# EAGLE design ardulight (EAGLE 7.1.0)
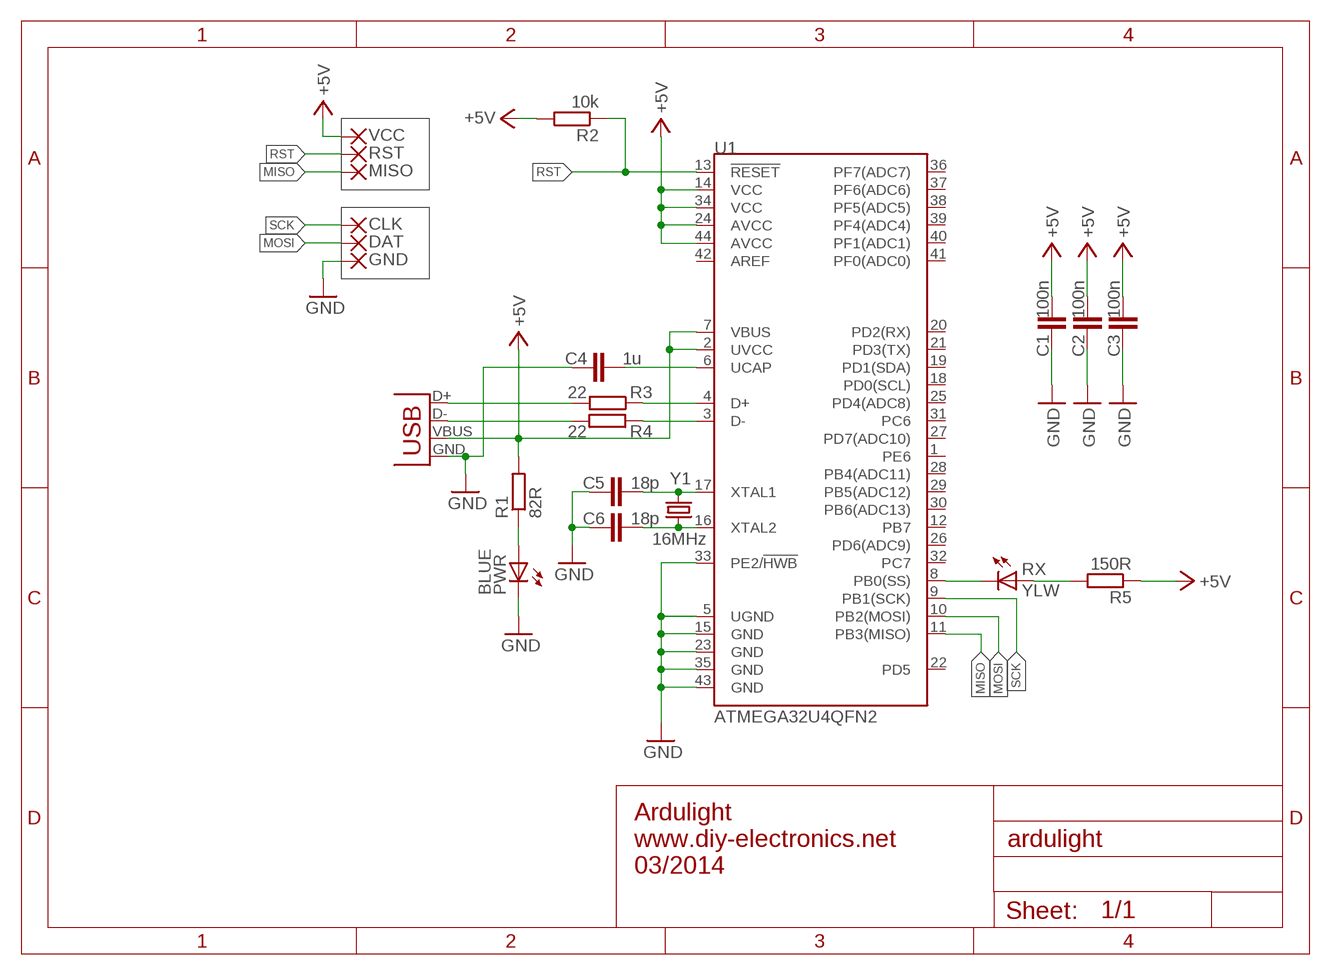
[diagram p0: schematic, sheet 1]

## Parts
C1  100n  C-EUC0603  [C0603]
C2  100n  C-EUC0603  [C0603]
C3  100n  C-EUC0603  [C0603]
C4  1u  C-EUC0603  [C0603]
C5  18p  C-EUC0603  [C0603]
C6  18p  C-EUC0603  [C0603]
CLK  SMD5  [SMD2,54-5,08]
DAT  SMD5  [SMD2,54-5,08]
GND  SMD5  [SMD2,54-5,08]
JP1  USBSMD  [USB-MINIB]
MISO  SMD2  [SMD1,27-2,54]
PWR  BLUE  LEDCHIPLED_0603  [CHIPLED_0603]
R1  82R  R-EU_R0603  [R0603]
R2  10k  R-EU_R0603  [R0603]
R3  22  R-EU_R0603  [R0603]
R4  22  R-EU_R0603  [R0603]
R5  150R  R-EU_R0603  [R0603]
RST  SMD2  [SMD1,27-2,54]
RX  YLW  LEDCHIPLED_0603  [CHIPLED_0603]
U1  ATMEGA32U4QFN2  [SPARKFUN-DIGITALIC_QFN-44-NOPAD]
VCC  SMD2  [SMD1,27-2,54]
Y1  16MHz  CRYSTAL5X3  [CRYSTAL-SMD-5X3]

## Nets
+5V: C1.2 C2.2 C3.2 JP1.VBUS R1.2 R2.2 R5.1 U1.2(UVCC) U1.7(VBUS) U1.14(VCC) U1.24(AVCC) U1.34(VCC) U1.44(AVCC) VCC.1(P)
GND: C1.1 C2.1 C3.1 C4.1 C5.1 C6.1 GND.1(P) JP1.GND PWR.C U1.5(UGND) U1.15(GND) U1.23(GND) U1.33(PE2/!HWB) U1.35(GND) U1.43(GND)
MISO: MISO.1(P) U1.11(PB3(MISO))
MOSI: DAT.1(P) U1.10(PB2(MOSI))
N$1: C5.2 U1.17(XTAL1) Y1.3
N$2: C6.2 U1.16(XTAL2) Y1.1
N$3: R3.1 U1.4(D+)
N$4: C4.2 U1.6(UCAP)
N$5: RX.C U1.8(PB0(SS))
N$6: R4.1 U1.3(D-)
N$7: JP1.D+ R3.2
N$8: JP1.D- R4.2
N$9: PWR.A R1.1
N$10: R5.2 RX.A
RST: R2.1 RST.1(P) U1.13(!RESET)
SCK: CLK.1(P) U1.9(PB1(SCK))
Unconnected: U1.1(PE6) U1.12(PB7) U1.18(PD0(SCL)) U1.19(PD1(SDA)) U1.20(PD2(RX)) U1.21(PD3(TX)) U1.22(PD5) U1.25(PD4(ADC8)) U1.26(PD6(ADC9)) U1.27(PD7(ADC10)) U1.28(PB4(ADC11)) U1.29(PB5(ADC12)) U1.30(PB6(ADC13)) U1.31(PC6) U1.32(PC7) U1.36(PF7(ADC7)) U1.37(PF6(ADC6)) U1.38(PF5(ADC5)) U1.39(PF4(ADC4)) U1.40(PF1(ADC1)) U1.41(PF0(ADC0)) U1.42(AREF)

## Notes on the sheet
- Ardulight
- www.diy-electronics.net
- 03/2014

## Library data of the parts
C1-C6 = rcl:C-EU: CAPACITOR, European symbol
CLK DAT GND = wirepad:SMD5: SMD PAD
JP1 = SparkFun-Connectors:USB: USB Connectors USB-B-PTH is fully proven SKU : PRT-00139/CONN-08278 USB-miniB is fully proven SKU : PRT-00587 USB-A-PCB is untested. USB-A-H is throughly reviewed, but untested. Spark Fun Electronics SKU : PRT-00437 USB-B-SMT is throughly reviewed, but untested. Needs silkscreen touching up. USB-A-S has not been used/tested USB-MB-H has not been used/tested USB-MICROB has been used. CONN-09505
MISO RST VCC = wirepad:SMD2: SMD PAD
PWR RX = adafruit:LED: LED OSRAM: - CHIPLED LG R971, LG N971, LY N971, LG Q971, LY Q971, LO R971, LY R971 LH N974, LH R974 LS Q976, LO Q976, LY Q976 LO Q996 - Hyper CHIPLED LW Q18S LB Q993, LB Q99A, LB R99A - SideLED LS A670, LO A670, LY A670, LG A670, LP A670 LB A673, LV A673, LT A673, LW A673 LH A674 LY A675 LS A676, LA A676, LO A676, LY A676, LW A676 LS A679, LY A679, LG A679 - Hyper Micro SIDELED® LS Y876, LA Y876, LO Y876, LY Y876 LT Y87S - SmartLED LW L88C, LW L88S LB L89C, LB L89S, LG L890 LS L89K, LO L89K, LY L89K LS L896, LA L896, LO L896, LY L896 - TOPLED LS T670, LO T670, LY T670, LG T670, LP T670 LSG T670, LSP T670, LSY T670, LOP T670, LYG T670 LG T671, LOG T671, LSG T671 LB T673, LV T673, LT T673, LW T673 LH T674 LS T676, LA T676, LO T676, LY T676, LB T676, LH T676, LSB T676, LW T676 LB T67C, LV T67C, LT T67C, LS T67K, LO T67K, LY T67K, LW E67C LS E67B, LA E67B, LO E67B, LY E67B, LB E67C, LV E67C, LT E67C LW T67C LS T679, LY T679, LG T679 LS T770, LO T770, LY T770, LG T770, LP T770 LB T773, LV T773, LT T773, LW T773 LH T774 LS E675, LA E675, LY E675, LS T675 LS T776, LA T776, LO T776, LY T776, LB T776 LHGB T686 LT T68C, LB T68C - Hyper Mini TOPLED® LB M676 - Mini TOPLED Santana® LG M470 LS M47K, LO M47K, LY M47K Source: http://www.osram.convergy.de/
R1-R5 = rcl:R-EU_: RESISTOR, European symbol
U1 = SparkFun-DigitalIC:ATMEGA32U4: Atmel 44-pin 8-bit Microcontroller with 32KBytes of ISP Flash and USB Controller ----- Please use the QFN-44-NOPAD_1:1 package for the footprint of all boards using a 32U4. Route traces directly away from the pads as much as possible.
Y1 = SparkFun-FreqCtrl:CRYSTAL: Various standard crystals. Proven footprints. Spark Fun Electronics SKU : COM-00534

## Board
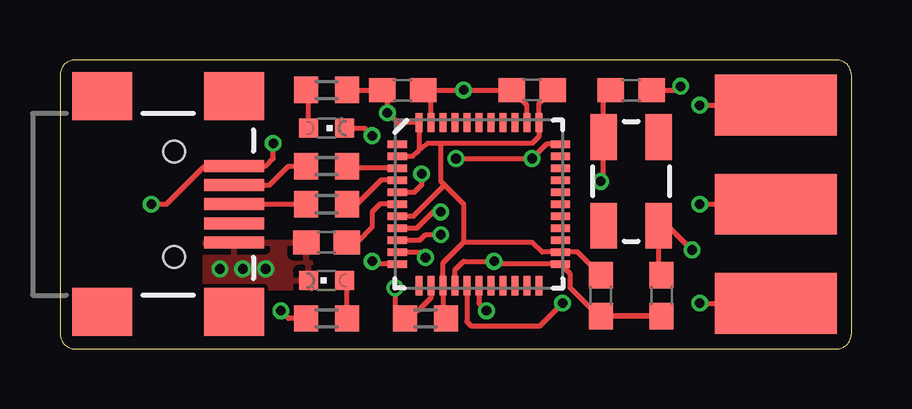
[diagram p1: board, top side]
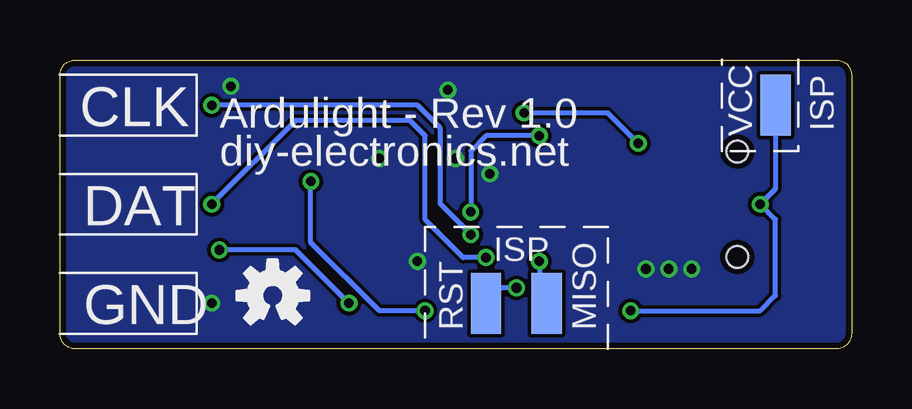
[diagram p2: board, bottom side, seen from below]

Size 33 x 12.05 mm. Coordinates in mm from the lower left corner, seen from the top.
Outline: 32.37,12.05 0.64,12.05 arc90 0,11.42 0,0.64 arc90 0.64,0 32.37,0 arc90 33,0.64 33,11.42 arc90 32.37,12.05
Copper layers (1*16): Top 0.035mm / dielectric 1.5mm / Bottom 0.035mm
Design rules "SeeedStudio_2layer_DRU_no_angle_20140221": minimum track width 6mil, minimum drill 12mil, track to track 6mil, track to pad 6mil, pad to pad 6mil, via to via 6mil, smd to smd 0mil, copper to edge 10mil, drill to drill 10mil, minimum pad ring 10mil, minimum via ring 6mil, stop-mask expansion 2mil, vias tented up to drill 100mil, thermal gap 10mil

### Footprints (pad centres in the part's own frame; a part is rotated, then mirrored left to right if it is on the bottom)
C0603 = smd 1.1 x 1: 1 -0.85,0; 2 0.85,0
SMD2,54-5,08 = smd 2.54 x 5.08: 1 0,0
USB-MINIB = smd 2.5 x 0.5: D+ 2.5,0; D- 2.5,0.8; GND 2.5,-1.6; ID 2.5,-0.8; VBUS 2.5,1.6 | smd 2.5 x 2: MTN1 -3,4.5; MTN2 2.5,4.5; MTN3 -3,-4.5; MTN4 2.5,-4.5 | hole 0.9: 0,2.2; 0,-2.2
SMD1,27-2,54 = smd 1.27 x 2.54: 1 0,0
CHIPLED_0603 = smd 0.8 x 0.8: A 0,-0.75; C 0,0.75
R0603 = smd 1 x 1.1: 1 -0.85,0; 2 0.85,0
SPARKFUN-DIGITALIC_QFN-44-NOPAD = smd 0.8 x 0.3: 1 -3.4,2.5; 2 -3.4,2; 3 -3.4,1.5; 4 -3.4,1; 5 -3.4,0.5; 6 -3.4,0; 7 -3.4,-0.5; 8 -3.4,-1; 9 -3.4,-1.5; 10 -3.4,-2; 11 -3.4,-2.5; 23 3.4,-2.5; 24 3.4,-2; 25 3.4,-1.5; 26 3.4,-1; 27 3.4,-0.5; 28 3.4,0; 29 3.4,0.5; 30 3.4,1; 31 3.4,1.5; 32 3.4,2; 33 3.4,2.5 | smd 0.3 x 0.8: 12 -2.5,-3.4; 13 -2,-3.4; 14 -1.5,-3.4; 15 -1,-3.4; 16 -0.5,-3.4; 17 0,-3.4; 18 0.5,-3.4; 19 1,-3.4; 20 1.5,-3.4; 21 2,-3.4; 22 2.5,-3.4; 34 2.5,3.4; 35 2,3.4; 36 1.5,3.4; 37 1,3.4; 38 0.5,3.4; 39 0,3.4; 40 -0.5,3.4; 41 -1,3.4; 42 -1.5,3.4; 43 -2,3.4; 44 -2.5,3.4
CRYSTAL-SMD-5X3 = smd 1.9 x 1.1: 1 -1.85,-1.15; 2 1.85,-1.15; 3 1.85,1.15; 4 -1.85,1.15

### Placement (x,y rotation side)
C1  19.68,10.79 0 top
C2  22.54,2.22 90 top
C3  14.29,10.79 180 top
C4  11.11,4.45 0 top
C5  23.81,10.79 180 top
C6  25.08,2.22 90 top
CLK  29.84,10.16 90 top
DAT  29.84,6.03 90 top
GND  29.84,1.91 90 top
JP1  4.76,6.03 0 top
MISO  12.7,1.91 0 bottom
PWR  11.11,2.86 90 top
R1  11.11,1.27 180 top
R2  15.24,1.27 0 top
R3  11.11,6.03 180 top
R4  11.11,7.62 180 top
R5  11.11,10.79 180 top
RST  15.24,1.91 0 bottom
RX  11.11,9.21 270 top
U1  17.46,6.03 0 top
U$1  [OSHW-LOGO-S]  24.13,2.22 0 bottom
VCC  3.17,10.16 180 bottom
Y1  23.81,6.99 90 top

### Tracks (layer width: path | path; a pad name or v marks a point on that pad's centre or on a via)
+5V  (via drill 0.4)
  Top 0.203: R5.1 C3.2 13.65,10.58 v13.65,9.84 14.06,9.43 U1.44 14.96,8.29 | U1.2 14.7,8.03 14.96,8.29 | 15.88,8.57 19.68,8.57 19.96,8.85 U1.34 19.96,10.22 C1.2 | 15.88,8.57 15.32,8.57 14.96,8.29 | 15.88,8.57 15.88,6.99 16.03,6.83 | 16.03,6.83 16.83,6.03 16.83,4.45 | 16.83,4.45 15.96,3.58 U1.14 15.96,1.4 R2.2 | C2.2 21.58,4.03 U1.24 20.1,4.03 19.68,4.45 16.83,4.45 | v8.89,8.57 8.89,7.94 8.59,7.63 JP1.VBUS 6.03,7.62 4.45,6.03 v3.81,6.03 | U1.7 14.74,5.53 16.03,6.83 | R1.2 9.53,1.27 v9.21,1.59
  Bottom 0.203: v8.89,8.57 10.16,9.84 v13.65,9.84 | v9.21,1.59 3.81,1.59 3.17,2.22 3.17,5.4 v3.81,6.03 3.17,6.67 VCC.1
GND  (via drill 0.4)
  Top 0.203: U1.35 19.46,10.17 C1.1 v16.83,10.79 15.24,10.79 15.46,10.57 U1.43 15.46,10.47 C3.1 | C2.1 C6.1 22.44,1.37 21.27,2.54 21.27,3.12 U1.23 18.22,3.53 v18.1,3.65 16.83,3.65 16.46,3.29 U1.15 | U1.5 14.79,6.53 15.08,6.83 v15.08,7.3 | U1.33 20.28,8.53 v19.68,7.94 v16.51,7.94 | C5.1 25.72,10.79 v25.88,10.95 | v26.67,1.91 GND.1
  other vias: 6.67,3.33 7.62,3.33 8.57,3.33
  pour Bottom: 32.7,0.32 0.57,0.32 arc-90 0.32,0.57 0.32,11.49 arc-90 0.57,11.75 32.45,11.75 arc-90 32.7,11.49
  pour Top: 6.03,4.45 6.03,2.54 10.48,2.54 10.48,4.45
MISO  (via drill 0.4)
  Top 0.203: U1.11 13.14,3.53 v13.02,3.65
  Bottom 0.203: v13.02,3.65 13.02,2.22 MISO.1
MOSI  (via drill 0.4)
  Top 0.203: U1.10 15.02,4.03 v15.24,3.81 | v26.67,6.03 DAT.1
  Bottom 0.203: v26.67,6.03 23.18,9.53 18.41,9.53 17.78,8.89 17.78,5.4 16.19,3.81 v15.24,3.81
N$1  (via drill 0.4)
  Top 0.203: U1.17 17.46,1.91 v17.78,1.59 | v22.54,6.99 22.66,7.11 Y1.3 22.66,10.49 C5.2
  Bottom 0.203: v17.78,1.59 19.68,1.59 22.54,4.45 v22.54,6.99
N$2  (via drill 0.4)
  Top 0.203: U1.16 16.96,1.14 17.14,0.95 20,0.95 v20.95,1.91 | v26.35,4.13 25.34,5.13 Y1.1 24.96,3.19 C6.2
  Bottom 0.203: v20.95,1.91 23.18,4.13 v26.35,4.13
N$3
  Top 0.203: U1.4 13.38,7.03 12.38,6.03 R3.1
N$4
  Top 0.203: U1.6 13.34,6.03 13.02,5.71 13.02,5.08 12.38,4.45 C4.2
N$5  (via drill 0.4)
  Top 0.203: RX.C 12.7,9.21 v13.02,8.89 | U1.8 14.88,5.03 15.56,5.71 v15.88,5.71
  Bottom 0.203: v13.02,8.89 15.24,8.89 15.88,8.26 v15.88,5.71
N$6
  Top 0.203: U1.3 12.05,7.53 R4.1
N$7
  Top 0.203: JP1.D+ R3.2
N$8
  Top 0.203: JP1.D- 8.74,6.83 9.53,7.62 R4.2
N$9
  Top 0.203: R1.1 11.96,2.76 PWR.A
N$10
  Top 0.203: RX.A 10.36,10.7 R5.2
RST  (via drill 0.4)
  Top 0.203: U1.13 15.46,2.13 14.92,1.59 14.71,1.59 R2.1 13.97,1.69 v13.97,2.54
  Bottom 0.203: v13.97,2.54 14.61,2.54 RST.1
SCK  (via drill 0.4)
  Top 0.203: U1.9 15.01,4.53 15.24,4.76 v15.88,4.76 | v26.67,10.16 CLK.1
  Bottom 0.203: v26.67,10.16 18.1,10.16 17.14,9.21 17.14,6.03 v15.88,4.76

### Text on the board
bPlace: ISP | Ardulight - Rev 1.0 | diy-electronics.net | ISP